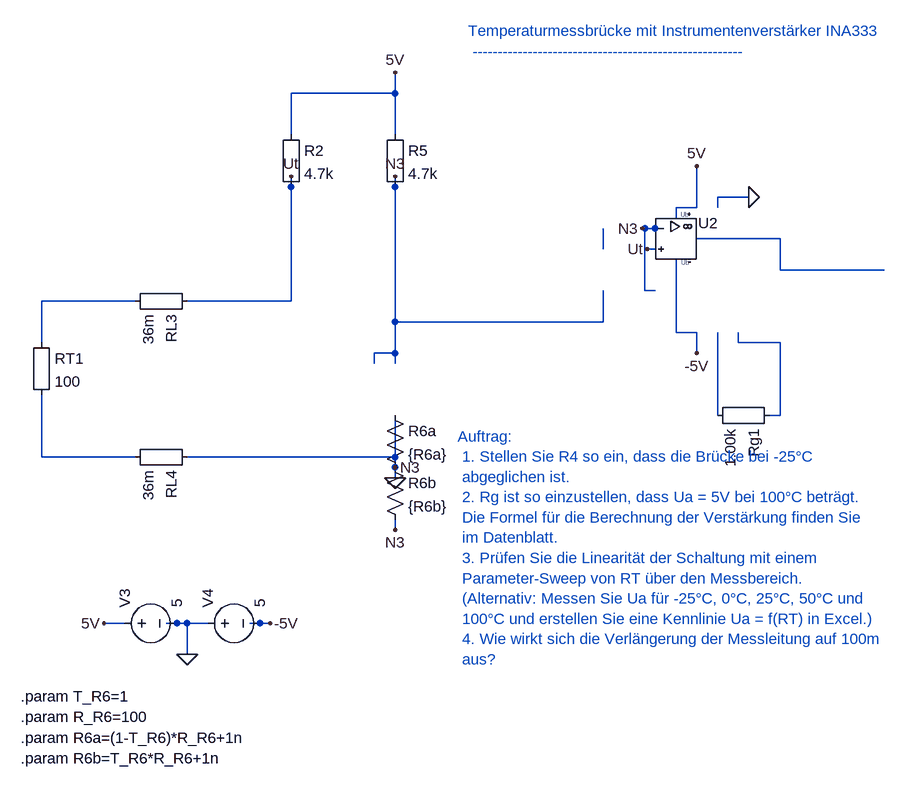
[diagram p0: schematic 1_4_2_PT100-Sensor_Bruecke_mit_INA333.asc]
1_4_2_PT100-Sensor_Bruecke_mit_INA333.asc, the LTspice schematic file:
Version 4
SHEET 1 880 680
WIRE 304 960 288 960
WIRE 1040 352 1024 352
WIRE 1024 352 1024 448
WIRE 1024 448 1040 448
WIRE 1072 336 1072 320
WIRE 1072 320 1104 320
WIRE 1072 400 1072 512
WIRE 1072 512 1104 512
WIRE 1104 368 1232 368
WIRE 1232 368 1232 416
WIRE 432 960 416 960
WIRE 96 608 96 704
WIRE 96 704 240 704
WIRE 288 960 320 960
WIRE 240 464 96 464
WIRE 96 464 96 528
WIRE 640 144 480 144
WIRE 480 144 480 208
WIRE 640 208 640 144
WIRE 640 736 640 704
WIRE 640 560 640 544
WIRE 608 560 608 544
WIRE 608 544 640 544
WIRE 640 704 320 704
WIRE 640 640 640 704
WIRE 640 288 640 496
WIRE 480 288 480 352
WIRE 480 352 480 464
WIRE 480 464 320 464
WIRE 960 384 960 352
WIRE 640 496 640 544
WIRE 960 448 960 496
WIRE 960 496 640 496
WIRE 1232 416 1392 416
WIRE 640 112 640 144
WIRE 1104 256 1104 320
WIRE 1184 304 1136 304
WIRE 1136 304 1136 320
WIRE 1136 640 1136 512
WIRE 1216 640 1232 640
WIRE 1232 640 1232 528
WIRE 1232 528 1168 528
WIRE 1168 528 1168 512
WIRE 320 960 320 1008
WIRE 352 960 320 960
WIRE 448 960 416 960
WIRE 1104 544 1104 512
WIRE 192 960 224 960
WIRE 480 288 480 272
WIRE 1040 384 1028 384
WIRE 640 288 640 272
WIRE 640 800 640 816
WIRE 1040 352 1020 352
FLAG 320 1008 0
FLAG 640 736 0
FLAG 1184 304 0
FLAG 320 1008 0
FLAG 640 736 0
FLAG 1184 304 0
FLAG 480 272 Ut
FLAG 1028 384 Ut
FLAG 640 272 N3
FLAG 640 816 N3
FLAG 640 720 N3
FLAG 1020 352 N3
FLAG 448 960 -5V
FLAG 1104 544 -5V
FLAG 640 112 5V
FLAG 1104 256 5V
FLAG 192 960 5V
SYMBOL Misc\EuropeanResistor 80 512 R0
SYMATTR InstName RT1
SYMATTR Value 100
SYMBOL Misc\EuropeanResistor 336 448 R90
SYMATTR InstName RL3
SYMATTR Value 36m
SYMBOL Misc\EuropeanResistor 336 688 R90
SYMATTR InstName RL4
SYMATTR Value 36m
SYMBOL voltage 208 960 R270
SYMATTR InstName V3
SYMATTR Value 5
SYMBOL Misc\EuropeanResistor 464 192 R0
SYMATTR InstName R2
SYMATTR Value 4.7k
SYMBOL Misc\EuropeanResistor 624 192 R0
SYMATTR InstName R5
SYMATTR Value 4.7k
SYMBOL res 624 624 R0
SYMATTR InstName R6a
SYMATTR Value {R6a}
SYMBOL res 624 704 R0
SYMATTR InstName R6b
SYMATTR Value {R6b}
SYMBOL UniversalOpAmp2 1072 368 R0
SYMATTR InstName U2
SYMATTR Value UniversalOpAmp2
SYMBOL Misc\EuropeanResistor 1232 624 R90
SYMATTR InstName Rg1
SYMATTR Value 1.00k
SYMBOL voltage 336 960 R270
SYMATTR InstName V4
SYMATTR Value 5
TEXT 64 1072 Left 2 !.param T_R6=1
TEXT 64 1104 Left 2 !.param R_R6=100
TEXT 64 1136 Left 2 !.param R6a=(1-T_R6)*R_R6+1n
TEXT 64 1168 Left 2 !.param R6b=T_R6*R_R6+1n
TEXT 752 48 Left 2 ;Temperaturmessbrücke mit Instrumentenverstärker INA333 \n ------------------------------------------------------
TEXT 736 672 Left 2 ;Auftrag: \n 1. Stellen Sie R4 so ein, dass die Brücke bei -25°C \n abgeglichen ist. \n 2. Rg ist so einzustellen, dass Ua = 5V bei 100°C beträgt. \n Die Formel für die Berechnung der Verstärkung finden Sie \n im Datenblatt. \n 3. Prüfen Sie die Linearität der Schaltung mit einem \n Parameter-Sweep von RT über den Messbereich. \n (Alternativ: Messen Sie Ua für -25°C, 0°C, 25°C, 50°C und \n 100°C und erstellen Sie eine Kennlinie Ua = f(RT) in Excel.) \n 4. Wie wirkt sich die Verlängerung der Messleitung auf 100m \n aus?

The netlist it stands for:
* 1_4_2_PT100-Sensor_Bruecke_mit_INA333.asc
RT1 N003 N002 100
RL3 Ut N003 36m
RL4 0 N002 36m
V3 5V 0 5
R2 5V Ut 4.7k
R5 5V 0 4.7k
R6a 0 0 {R6a}
R6b 0 0 {R6b}
XU2 Ut 0 5V -5V N001 level2 UniversalOpAmp2 Avol=1Meg GBW=10Meg Slew=10Meg Ilimit=25m Rail=0 Vos=0 En=0 Enk=0 In=0 Ink=0 Rin=500Meg  ; pins In+ In- V+ V- OUT
Rg1 N006 N005 1.00k
V4 0 -5V 5
.param T_R6=1
.param R_R6=100
.param R6a=(1-T_R6)*R_R6+1n
.param R6b=T_R6*R_R6+1n
* Temperaturmessbrücke mit Instrumentenverstärker INA333
*  ------------------------------------------------------
* Auftrag:
*  1. Stellen Sie R4 so ein, dass die Brücke bei -25°C
*  abgeglichen ist.
*  2. Rg ist so einzustellen, dass Ua = 5V bei 100°C beträgt.
*  Die Formel für die Berechnung der Verstärkung finden Sie
*  im Datenblatt.
*  3. Prüfen Sie die Linearität der Schaltung mit einem
*  Parameter-Sweep von RT über den Messbereich.
*  (Alternativ: Messen Sie Ua für -25°C, 0°C, 25°C, 50°C und
*  100°C und erstellen Sie eine Kennlinie Ua = f(RT) in Excel.)
*  4. Wie wirkt sich die Verlängerung der Messleitung auf 100m
*  aus?
.lib UniversalOpAmp2.lib
.backanno
.end